# Altium schematic sheet alimentacao.SchDoc
size A4; SheetNumber: 1; SheetTotal: 7
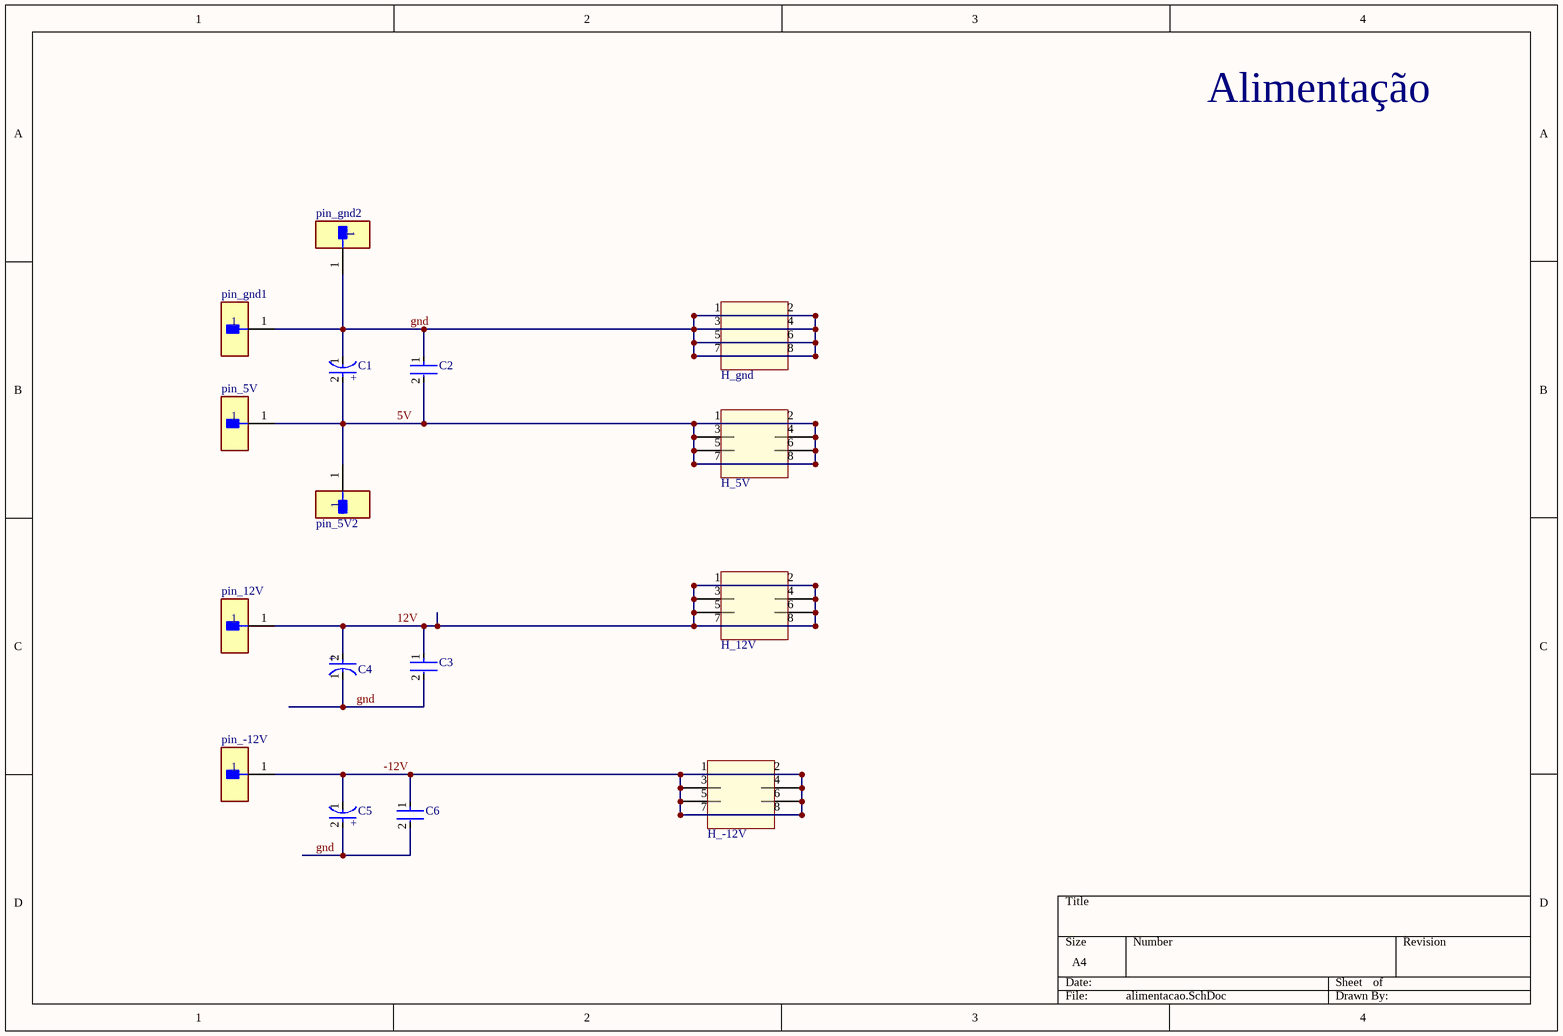
[diagram p0: alimentacao.SchDoc]

## Parts
C1  EEU-FM1H101BJ  [FP-FM8-MFG]  (value not drawn)
C2  RCER71H335K3K1H03B  [FP-RCE3M1-MFG]  (value not drawn)
C3  RCER71H335K3K1H03B  [FP-RCE3M1-MFG]  (value not drawn)
C4  EEU-FM1H101BJ  [FP-FM8-MFG]  (value not drawn)
C5  EEU-FM1H101BJ  [FP-FM8-MFG]  (value not drawn)
C6  RCER71H335K3K1H03B  [FP-RCE3M1-MFG]  (value not drawn)
H_5V  header 2x4  [header 2x4]  (value not drawn)
H_12V  header 2x4  [header 2x4]  (value not drawn)
H_-12V  header 2x4  [header 2x4]  (value not drawn)
H_gnd  header 2x4  [header 2x4]  (value not drawn)
pin_5V  TSW-101-07-L-S  [FP-TSW-101-07-L-S-MFG]  (value not drawn)
pin_5V2  TSW-101-07-L-S  [FP-TSW-101-07-L-S-MFG]  (value not drawn)
pin_12V  TSW-101-07-L-S  [FP-TSW-101-07-L-S-MFG]  (value not drawn)
pin_-12V  TSW-101-07-L-S  [FP-TSW-101-07-L-S-MFG]  (value not drawn)
pin_gnd1  TSW-101-07-L-S  [FP-TSW-101-07-L-S-MFG]  (value not drawn)
pin_gnd2  TSW-101-07-L-S  [FP-TSW-101-07-L-S-MFG]  (value not drawn)

## Nets
5V: C1.2(A) C2.2 H_5V.1 H_5V.2 H_5V.3 H_5V.4 H_5V.5 H_5V.6 H_5V.7 H_5V.8 pin_5V.1 pin_5V2.1
12V: C3.1 C4.2(A) H_12V.1 H_12V.2 H_12V.3 H_12V.4 H_12V.5 H_12V.6 H_12V.7 H_12V.8 pin_12V.1
-12V: C5.1(C) C6.1 H_-12V.1 H_-12V.2 H_-12V.3 H_-12V.4 H_-12V.5 H_-12V.6 H_-12V.7 H_-12V.8 pin_-12V.1
gnd: C1.1(C) C2.1 C3.2 C4.1(C) C5.2(A) C6.2 H_gnd.1 H_gnd.2 H_gnd.3 H_gnd.4 H_gnd.5 H_gnd.6 H_gnd.7 H_gnd.8 pin_gnd1.1 pin_gnd2.1

## Notes on the sheet
- Alimentação
- (in symbol CMP-05427-000021-1) +

## Library data of the parts
C1 C4 C5 = CMP-05427-000021-1: CAP ALUM 100UF 20% 50V RADIAL; Polarity: Polar; Impedance: 61mR; Ripple Current: 870mA; Life (Hours): 3000Hour; Dissipation Factor: 0.1%; Packaging: Ammo Pack; Voltage Rating (DC): 50V; Diameter: 8mm; Radiation Hardening: No; Max Operating Temperature: 105°C; Length: 11.5mm; Tolerance: 20%; Termination: Radial; Features: General Purpose; Case/Package: Radial; Voltage Rating: 50V; Min Operating Temperature: -40°C; Height - Seated (Max): 0.512inch; Mount: Through Hole; Series: FM; Height: 11.5mm; Capacitance: 100uF; ESR (Equivalent Series Resistance): 61mR; Lead Free: Lead Free; Lead Pitch: 0.197inch; Package Quantity: 1000
C2 C3 C6 = CMP-06035-028451-1: Cap Ceramic 3.3uF 50V X7R ±10% Radial 5mm +125°C Automotive Ammo Pack; Lead Diameter: 0.5mm; Lead/Base Style: Formed Leads; Height: 5mm; Ratings: AEC-Q200; Capacitance: 3.3uF; Package Quantity: 500; Length: 0.217inch; Min Operating Temperature: -55°C; Voltage Rating (DC): 50V; Dielectric: X7R; Case/Package: Radial; Height - Seated (Max): 0.197inch; Termination: Radial; Mount: Through Hole; Max Operating Temperature: 125°C; Width: 0.157inch; Voltage Rating: 50V; Packaging: Bulk; Resistor Type: Ceramic; Tolerance: 10%; Lead Pitch: 0.197inch
H_5V H_12V H_-12V H_gnd = header 2x4: header male 2x4; pin to pad: 1>C1 2>C2 3>C3 4>C4 5>C5 6>C6 7>C7 8>C8; Parameter 1: header 2x4
pin_5V pin_5V2 pin_12V pin_-12V pin_gnd1 pin_gnd2 = CMP-02766-001775-1: CONN HEADER VERT 1POS; Gender: Male; Number of Contacts: 1; Max Current Rating: 7.6A; Max Voltage Rating (AC): 550V; RoHS Compliant: Yes; Contact Finish - Mating: GOLD; Length: 2.54mm; Series: TSW; Insulation Material: PBT; Reach SVHC Compliant: Yes; Radiation Hardening: No; Contact Plating: Gold; Termination: Solder; Contact Type: Male Pin; Orientation: Straight; Number of Rows: 1; Depth: 2.54mm; Housing Material: Polyester; Lead Free: Lead Free; Fastening Type: Pull; Flammability Rating: UL94 V-0; Mount: Through Hole; Housing Color: Black; Contact Shape: Square; Min Operating Temperature: -55°C; Connector Type: Header; Contact Mating Length: 0.23inch; Width: 2.54mm; Packaging: Bulk; Contact Material: Bronze; Max Operating Temperature: 125°C; Number of Positions: 1; Color: Black; Insulation Color: Black